# Altium schematic sheet Programming interface.SchDoc
size A4
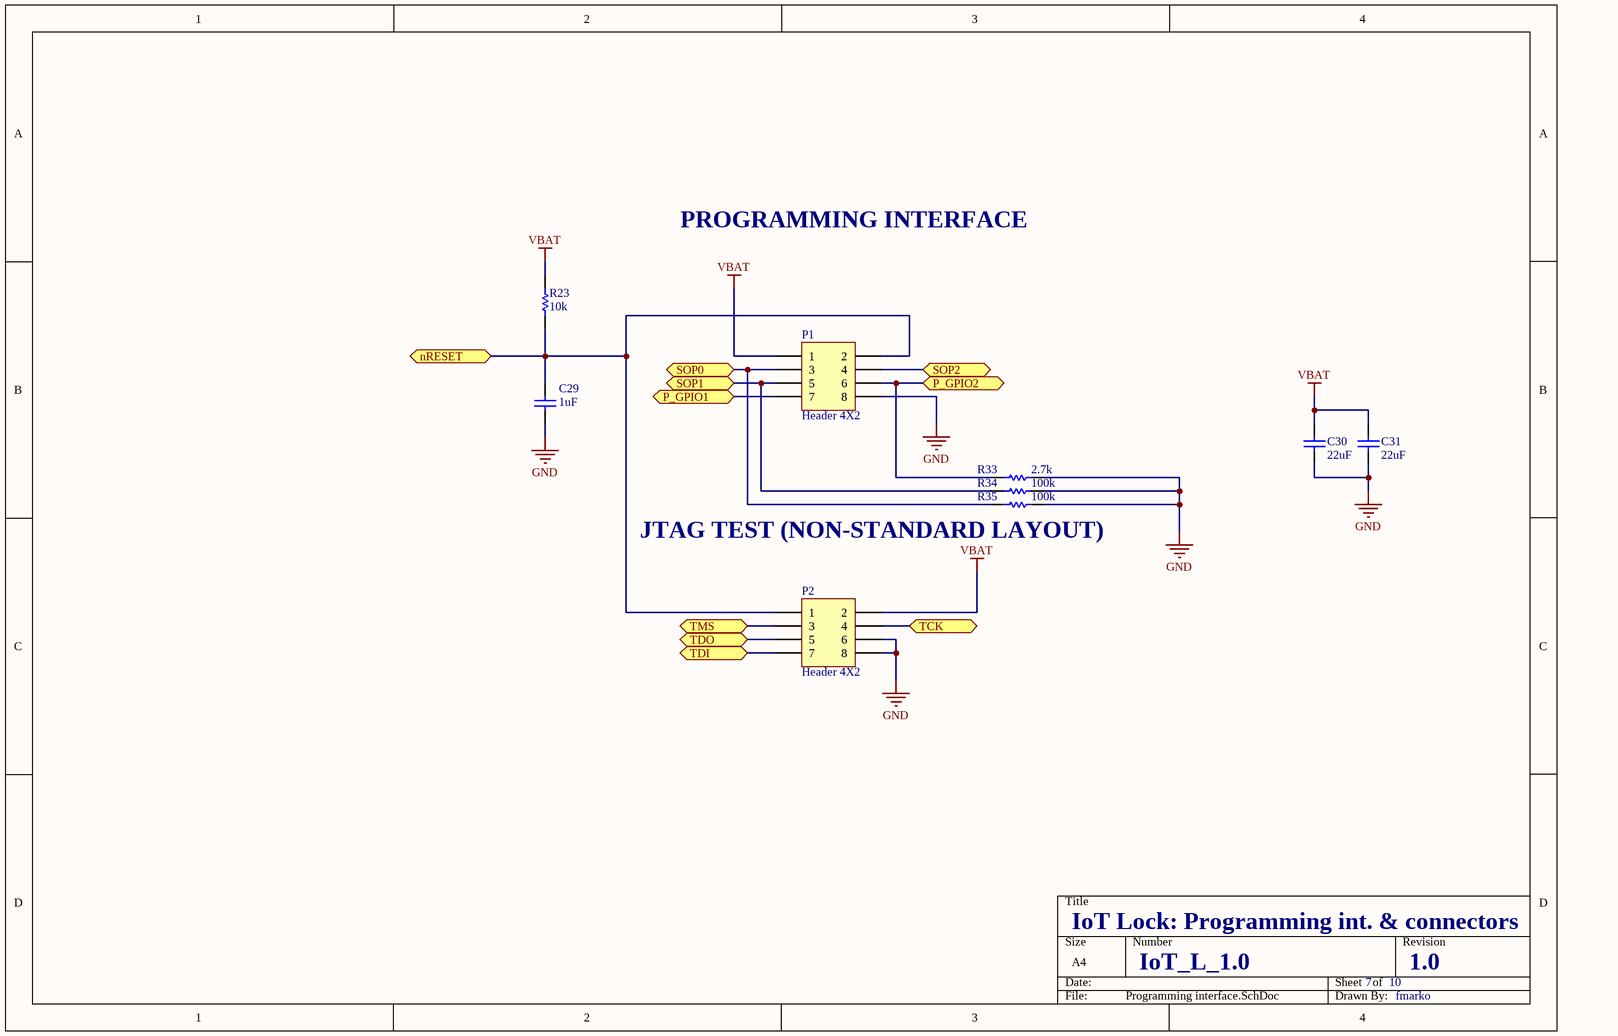
[diagram p0: Programming interface.SchDoc]

## Parts
C29  value 1uF  [0402]  (hidden comment: GRM1555C1HR50BA01D)
C30  value 22uF  [1608[0603]]  (hidden comment: GRM1555C1HR50BA01D)
C31  value 22uF  [1608[0603]]  (hidden comment: GRM1555C1HR50BA01D)
P1  Header 4X2  [HDR2X4]
P2  Header 4X2  [HDR2X4]
R23  value 10k  [0402]  (hidden comment: Res Semi)
R33  value 2.7k  [0402]  (hidden comment: Res Semi)
R34  value 100k  [0402]  (hidden comment: Res Semi)
R35  value 100k  [0402]  (hidden comment: Res Semi)

## Ports
nRESET, P_GPIO1, P_GPIO2, SOP0, SOP1, SOP2, TCK, TDI, TDO, TMS

## Nets
GND: C29.1 C30.1 C31.1 P1.8 P2.6 P2.8 R33.1 R34.1 R35.1
VBAT: C30.2 C31.2 P1.1 P2.2 R23.2
nRESET: C29.2 P1.2 P2.1 R23.1 ; port nRESET
P_GPIO1: P1.7 ; port P_GPIO1
P_GPIO2: P1.6 R33.2 ; port P_GPIO2
SOP0: P1.3 R35.2 ; port SOP0
SOP1: P1.5 R34.2 ; port SOP1
SOP2: P1.4 ; port SOP2
TCK: P2.4 ; port TCK
TDI: P2.7 ; port TDI
TDO: P2.5 ; port TDO
TMS: P2.3 ; port TMS

## Notes on the sheet
- PROGRAMMING INTERFACE
- (near R35) JTAG TEST (NON-STANDARD LAYOUT)
- IoT Lock: Programming int. & connectors
- IoT_L_1.0
- 7
- 10
- 1.0
- fmarko

## Library data of the parts
C29-C31 = Cap: Capacitor; Published: 8-Jun-2000; LatestRevisionDate: 17-Jul-2002; LatestRevisionNote: Re-released for DXP Platform.; PackageReference: RAD-0.3; Publisher: Altium Limited; PackageDescription: Radial Cap, Thru-Hole; 2 Leads; 0.3 in Pin Spacing
P1 P2 = Header 4X2: Header, 4-Pin, Dual row; LatestRevisionDate: 17-Jul-2002; LatestRevisionNote: Re-released for DXP Platform.; Publisher: Altium Limited
R23 R33-R35 = Res Semi: Semiconductor Resistor; Published: 8-Jun-2000; LatestRevisionDate: 17-Jul-2002; LatestRevisionNote: Re-released for DXP Platform.; PackageReference: AXIAL-0.5; Publisher: Altium Limited; PackageDescription: Axial Device, Thru-Hole; 2 Leads; 0.5 in Pin Spacing